# Altium schematic sheet FLEXI_HAL_Quark_Mezz.SchDoc: RP2040 CNC
size C; Author: AM; CompanyName: Expatria Technologies; DrawnBy: A.Marles; Engineer: AM; Organization: Expatria Technolgoies; Address1: Schematic; DocumentNumber: 2; SheetNumber: 2; SheetTotal: 14
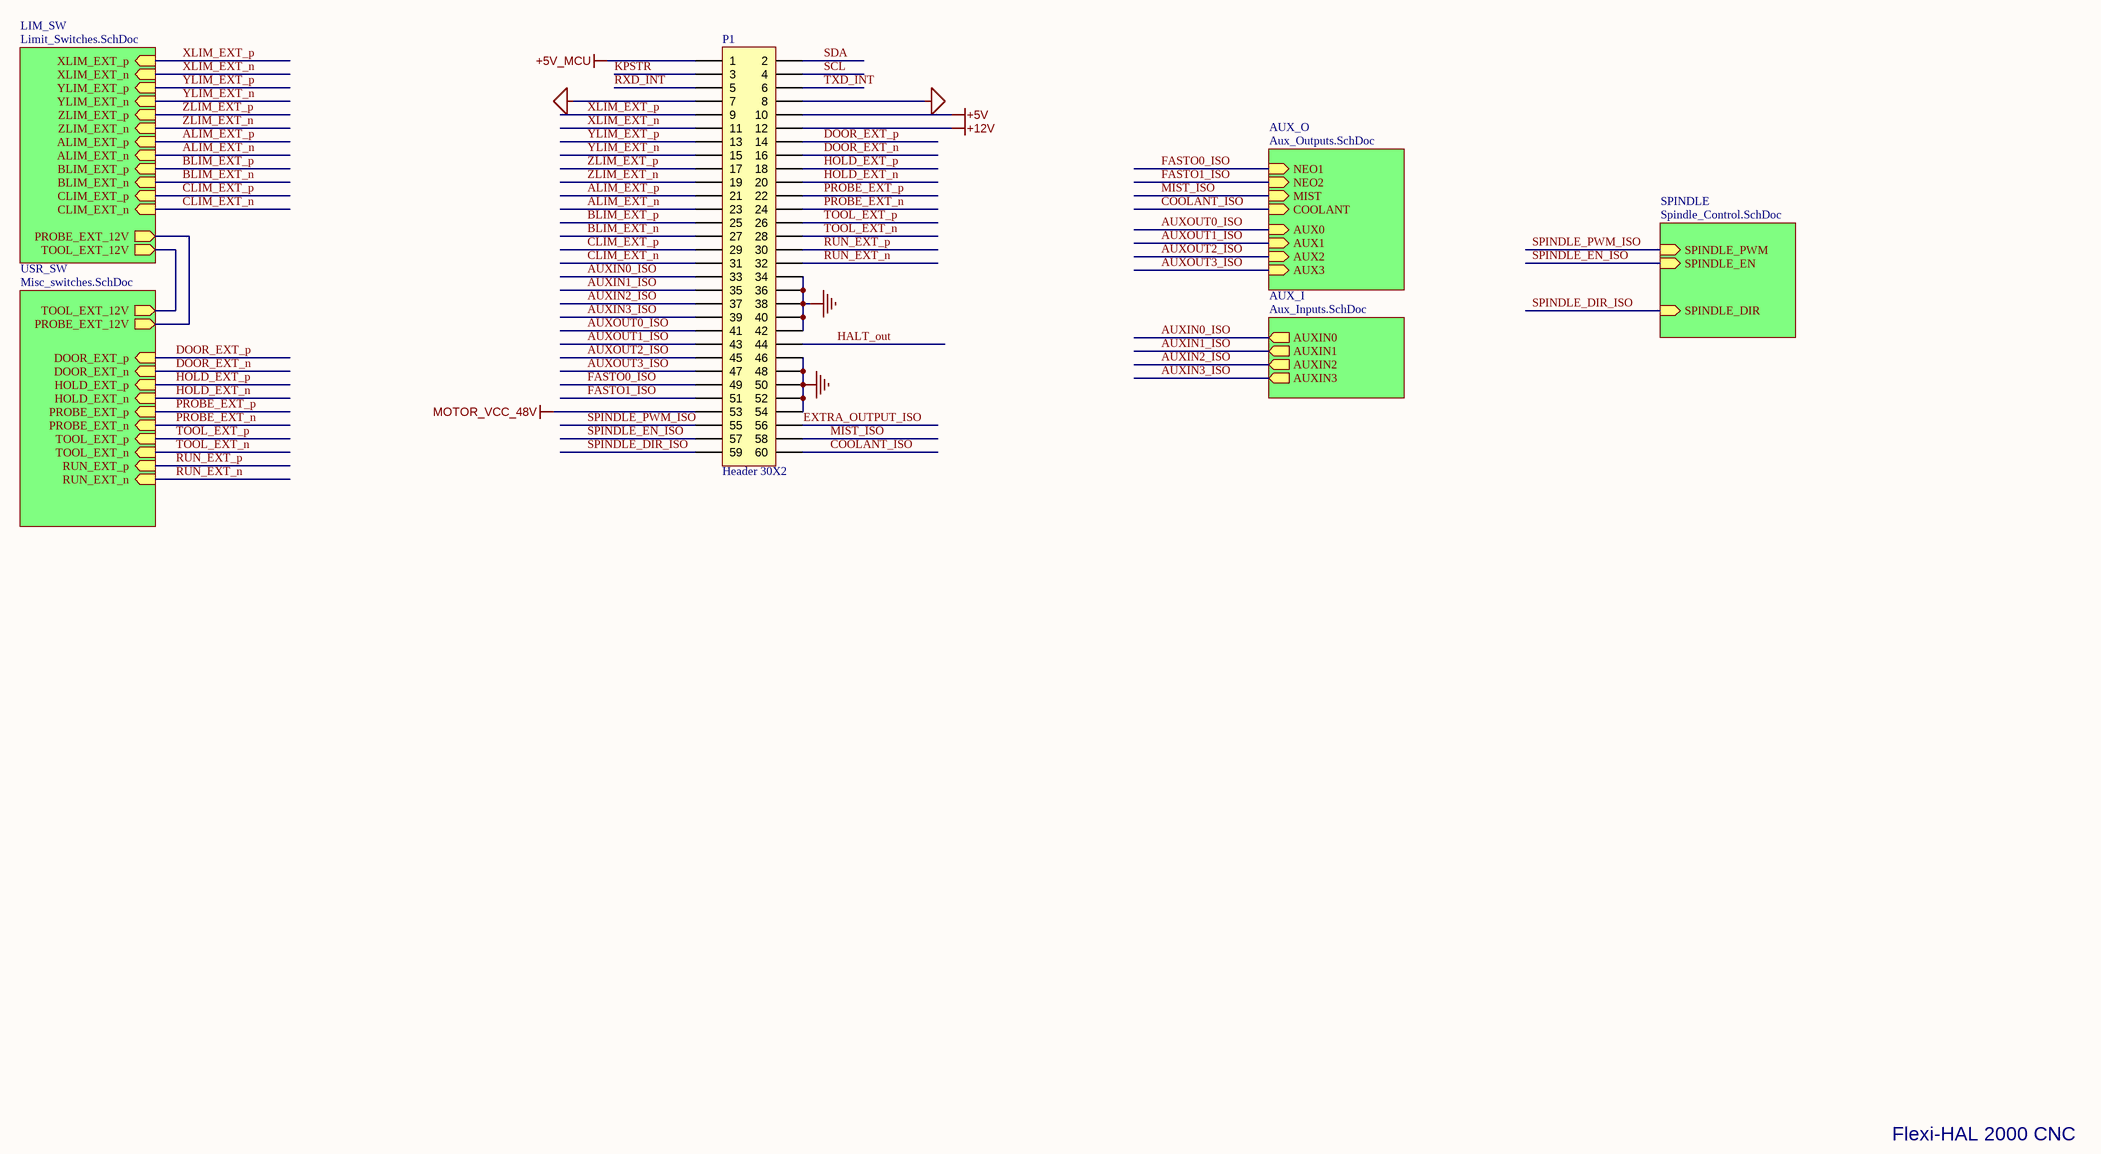
[diagram p0: FLEXI_HAL_Quark_Mezz.SchDoc]

## Parts
P1  Header 30X2  [Flexi-Quark-Mezzanine - BOTTOM]

## Sub-sheets
AUX_I = Aux_Inputs.SchDoc: AUXIN3 (out), AUXIN0 (out), AUXIN1 (out), AUXIN2 (out)
AUX_O = Aux_Outputs.SchDoc: AUX3 (in), AUX0 (in), AUX1 (in), AUX2 (in), COOLANT (in), MIST (in), NEO2 (in), NEO1 (in)
LIM_SW = Limit_Switches.SchDoc: PROBE_EXT_12V (out), TOOL_EXT_12V (out), CLIM_EXT_n (in), BLIM_EXT_n (in), ALIM_EXT_n (in), BLIM_EXT_p (in), CLIM_EXT_p (in), ALIM_EXT_p (in), ZLIM_EXT_p (in), XLIM_EXT_n (in), XLIM_EXT_p (in), ZLIM_EXT_n (in), YLIM_EXT_n (in), YLIM_EXT_p (in)
SPINDLE = Spindle_Control.SchDoc: SPINDLE_EN (in), SPINDLE_DIR (in), SPINDLE_PWM (in)
USR_SW = Misc_switches.SchDoc: PROBE_EXT_n (in), RUN_EXT_p (in), PROBE_EXT_p (in), DOOR_EXT_n (in), TOOL_EXT_n (in), TOOL_EXT_p (in), HOLD_EXT_n (in), RUN_EXT_n (in), HOLD_EXT_p (in), DOOR_EXT_p (in), TOOL_EXT_12V (out), PROBE_EXT_12V (out)

## Nets
+5V: P1.10
+5V_MCU: P1.1
+12V: P1.12
GND: P1.34 P1.36 P1.38 P1.40 P1.42 P1.46 P1.48 P1.50 P1.52 P1.54
MCU_GND: P1.7 P1.8
MOTOR_VCC_48V: P1.53
ALIM_EXT_n: P1.23 ; sheet LIM_SW/ALIM_EXT_n
ALIM_EXT_p: P1.21 ; sheet LIM_SW/ALIM_EXT_p
AUXIN0_ISO: P1.33 ; sheet AUX_I/AUXIN0
AUXIN1_ISO: P1.35 ; sheet AUX_I/AUXIN1
AUXIN2_ISO: P1.37 ; sheet AUX_I/AUXIN2
AUXIN3_ISO: P1.39 ; sheet AUX_I/AUXIN3
AUXOUT0_ISO: P1.41 ; sheet AUX_O/AUX0
AUXOUT1_ISO: P1.43 ; sheet AUX_O/AUX1
AUXOUT2_ISO: P1.45 ; sheet AUX_O/AUX2
AUXOUT3_ISO: P1.47 ; sheet AUX_O/AUX3
BLIM_EXT_n: P1.27 ; sheet LIM_SW/BLIM_EXT_n
BLIM_EXT_p: P1.25 ; sheet LIM_SW/BLIM_EXT_p
CLIM_EXT_n: P1.31 ; sheet LIM_SW/CLIM_EXT_n
CLIM_EXT_p: P1.29 ; sheet LIM_SW/CLIM_EXT_p
COOLANT_ISO: P1.60 ; sheet AUX_O/COOLANT
DOOR_EXT_n: P1.16 ; sheet USR_SW/DOOR_EXT_n
DOOR_EXT_p: P1.14 ; sheet USR_SW/DOOR_EXT_p
EXTRA_OUTPUT_ISO: P1.56
FASTO0_ISO: P1.49 ; sheet AUX_O/NEO1
FASTO1_ISO: P1.51 ; sheet AUX_O/NEO2
HALT_out: P1.44
HOLD_EXT_n: P1.20 ; sheet USR_SW/HOLD_EXT_n
HOLD_EXT_p: P1.18 ; sheet USR_SW/HOLD_EXT_p
KPSTR: P1.3
MIST_ISO: P1.58 ; sheet AUX_O/MIST
PROBE_EXT_n: P1.24 ; sheet USR_SW/PROBE_EXT_n
PROBE_EXT_p: P1.22 ; sheet USR_SW/PROBE_EXT_p
RUN_EXT_n: P1.32 ; sheet USR_SW/RUN_EXT_n
RUN_EXT_p: P1.30 ; sheet USR_SW/RUN_EXT_p
RXD_INT: P1.5
SCL: P1.4
SDA: P1.2
SPINDLE_DIR_ISO: P1.59 ; sheet SPINDLE/SPINDLE_DIR
SPINDLE_EN_ISO: P1.57 ; sheet SPINDLE/SPINDLE_EN
SPINDLE_PWM_ISO: P1.55 ; sheet SPINDLE/SPINDLE_PWM
TOOL_EXT_n: P1.28 ; sheet USR_SW/TOOL_EXT_n
TOOL_EXT_p: P1.26 ; sheet USR_SW/TOOL_EXT_p
TXD_INT: P1.6
XLIM_EXT_n: P1.11 ; sheet LIM_SW/XLIM_EXT_n
XLIM_EXT_p: P1.9 ; sheet LIM_SW/XLIM_EXT_p
YLIM_EXT_n: P1.15 ; sheet LIM_SW/YLIM_EXT_n
YLIM_EXT_p: P1.13 ; sheet LIM_SW/YLIM_EXT_p
ZLIM_EXT_n: P1.19 ; sheet LIM_SW/ZLIM_EXT_n
ZLIM_EXT_p: P1.17 ; sheet LIM_SW/ZLIM_EXT_p
(unnamed): sheet LIM_SW/PROBE_EXT_12V, sheet USR_SW/PROBE_EXT_12V
(unnamed): sheet LIM_SW/TOOL_EXT_12V, sheet USR_SW/TOOL_EXT_12V

## Notes on the sheet
- Flexi-HAL 2000 CNC
- Expatria Technologies
- SHEET
- PROJECT
- REV
- 1136 Glade Court
- Port Coquitlam, BC V3B 1R5
- EMAIL: INFO@EXPATRIA.CA
- SIZE
- ENGR
- C
- MODIFIED
- DOCUMENT
- /
- Copyright Expatria Technologies 2022. This document describes Open Hardware and is licensed under the CERN-OHL-S v2. No warranty is implied or expressed.

## Library data of the parts
P1 = Header 30X2: Header, 30-Pin, Dual row; LatestRevisionDate: 17-Jul-2002; LatestRevisionNote: Re-released for DXP Platform.; Publisher: Altium Limited